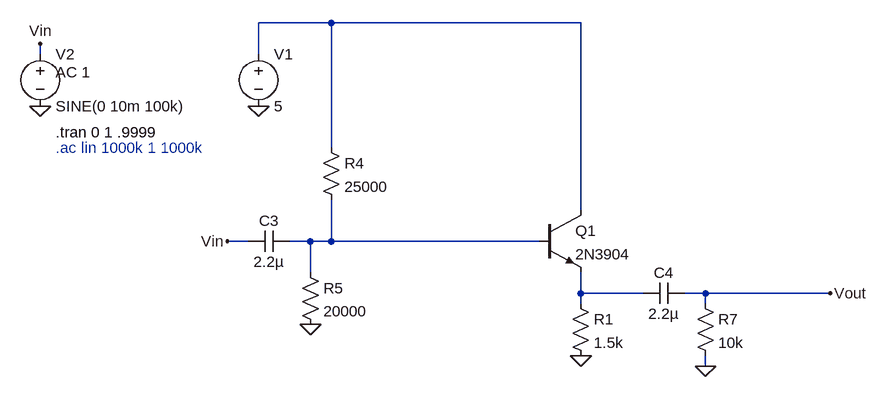
[diagram p0: schematic 04B-010.asc]
04B-010.asc, the LTspice schematic file:
Version 4.1
SHEET 1 880 680
WIRE -160 -144 -272 -144
WIRE 224 -144 -160 -144
WIRE -608 -96 -608 -112
WIRE -272 -96 -272 -144
WIRE -160 48 -160 -144
WIRE 224 144 224 -144
WIRE -288 192 -320 192
WIRE -192 192 -224 192
WIRE -160 192 -160 128
WIRE -160 192 -192 192
WIRE 160 192 -160 192
WIRE -192 240 -192 192
WIRE 224 272 224 240
WIRE 320 272 224 272
WIRE 416 272 384 272
WIRE 608 272 416 272
WIRE 224 288 224 272
WIRE 416 288 416 272
WIRE 416 384 416 368
FLAG -192 320 0
FLAG -272 -16 0
FLAG -608 -16 0
FLAG -608 -112 Vin
FLAG 608 272 Vout
FLAG 416 384 0
FLAG -320 192 Vin
FLAG 224 368 0
SYMBOL npn 160 144 R0
SYMATTR InstName Q1
SYMATTR Value 2N3904
SYMBOL res 208 272 R0
SYMATTR InstName R1
SYMATTR Value 1.5k
SYMBOL res -176 32 R0
SYMATTR InstName R4
SYMATTR Value 25000
SYMBOL res -208 224 R0
SYMATTR InstName R5
SYMATTR Value 20000
SYMBOL voltage -272 -112 R0
WINDOW 123 0 0 Left 0
WINDOW 39 0 0 Left 0
SYMATTR InstName V1
SYMATTR Value 5
SYMBOL voltage -608 -112 R0
WINDOW 123 24 44 Left 2
WINDOW 39 0 0 Left 0
SYMATTR Value2 AC 1
SYMATTR InstName V2
SYMATTR Value SINE(0 10m 100k)
SYMBOL cap -224 176 R90
WINDOW 0 0 32 VBottom 2
WINDOW 3 32 32 VTop 2
SYMATTR InstName C3
SYMATTR Value 2.2µ
SYMBOL cap 384 256 R90
WINDOW 0 0 32 VBottom 2
WINDOW 3 32 32 VTop 2
SYMATTR InstName C4
SYMATTR Value 2.2µ
SYMBOL res 400 272 R0
SYMATTR InstName R7
SYMATTR Value 10k
TEXT -584 24 Left 2 !.tran 0 1 .9999
TEXT -584 48 Left 2 ;.ac lin 1000k 1 1000k

The netlist it stands for:
* 04B-010.asc
Q1 N001 N002 N003 0 2N3904
R1 N003 0 1.5k
R4 N001 N002 25000
R5 N002 0 20000
V1 N001 0 5
V2 Vin 0 SINE(0 10m 100k) AC 1
C3 N002 Vin 2.2µ
C4 Vout N003 2.2µ
R7 Vout 0 10k
.model NPN NPN
.model PNP PNP
.lib standard.bjt
.tran 0 1 .9999
* .ac lin 1000k 1 1000k
.backanno
.end